# Altium schematic sheet 2T.SchDoc
size A4
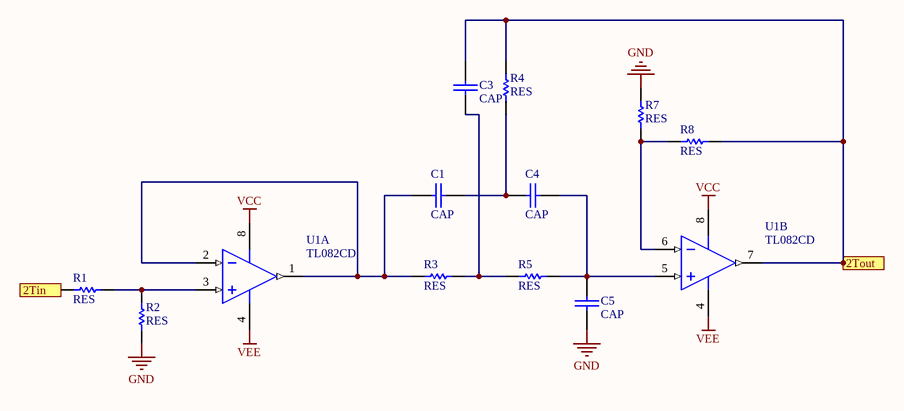
[diagram p0: 2T.SchDoc]

## Parts
C1  CAP  [1206]
C3  CAP  [1206]
C4  CAP  [1206]
C5  CAP  [1206]
R1  RES  [1206]
R2  RES  [1206]
R3  RES  [1206]
R4  RES  [1206]
R5  RES  [1206]
R7  RES  [1206]
R8  RES  [1206]
U1  TL082CD  [TI-D8_M]  (parts A,B of 2)

## Ports
2Tin, 2Tout

## Nets
GND: C5.1 R2.1 R7.2
VCC: U1.8(VCC+)
VEE: U1.4(VCC-)
2Tin: R1.1 ; port 2Tin
2Tout: C3.2 R4.2 R8.1 U1.7(OUT2) ; port 2Tout
NetC1_1: C1.1 R3.1 U1.1(OUT1) U1.2(IN1-)
NetC1_2: C1.2 C4.1 R4.1
NetC3_1: C3.1 R3.2 R5.1
NetC4_2: C4.2 C5.2 R5.2 U1.5(IN2+)
NetR1_2: R1.2 R2.2 U1.3(IN1+)
NetR7_1: R7.1 R8.2 U1.6(IN2-)

## Library data of the parts
U1 = TL082CD: JFET-Input Operational Amplifier, 7 to 36 V, 0 to 70 degC, 8-pin SOIC (D8), Green (RoHS & no Sb/Br); Manufacturer: Texas Instruments; CMRR(Min)(dB): 70; GBW(Typ)(MHz): 3; IIB(Max)(pA): 400; Iq per channel(Max)(mA): 2.8; Number of Channels: 2; Offset Drift(Typ)(uV/C): 18; Rating: Catalog; Slew Rate(Typ)(V/us): 13; Sub Family: General Purpose Amplifier, High Supply Voltage Amplifier (>=30V); Total Supply Voltage(Max)(+5V is 5, +/-5V is 10): 36; Total Supply Voltage(Min)(+5V is 5, +/-5V is 10): 7; Vio (25C)(Max)(mV): 15; DatasheetVersion: SLOS081G; PackageVersion: 4040047-3/M, 06/2011; PackageReference: D8; PackageDescription: 8-Pin Plastic Small Outline, Body 4.9 x 3.9 mm, Pitch 1.27 mm; Supplier 1: Digi-Key; Supplier Part Number 1: 296-1284-5-ND; Supplier 2: Farnell; Supplier Part Number 2: 1103183; Supplier 3: Newark; Supplier Part Number 3: 35K1261; Supplier 4: Mouser; Supplier Part Number 4: 595-TL082CD; Eco-Plan: Green (RoHS & no Sb/Br); Vn at 1kHz(Typ)(nV/rtHz): 18; Mounting Technology: Surface Mount; Code_JEDEC: MS-012; PartNumber: TL082CD; ComponentLink1Description: Manufacturer URL; ComponentLink1URL: http://www.ti.com/; ComponentLink2Description: Datasheet; ComponentLink2URL: http://www.ti.com/lit/ds/symlink/tl082.pdf; ComponentLink3Description: Package Specification; ComponentLink3URL: http://www.ti.com/litv/pdf/msoi002j